# Altium schematic sheet Diff-Probe_Topsheet.SchDoc
size A3; SheetNumber: 1; SheetTotal: 2
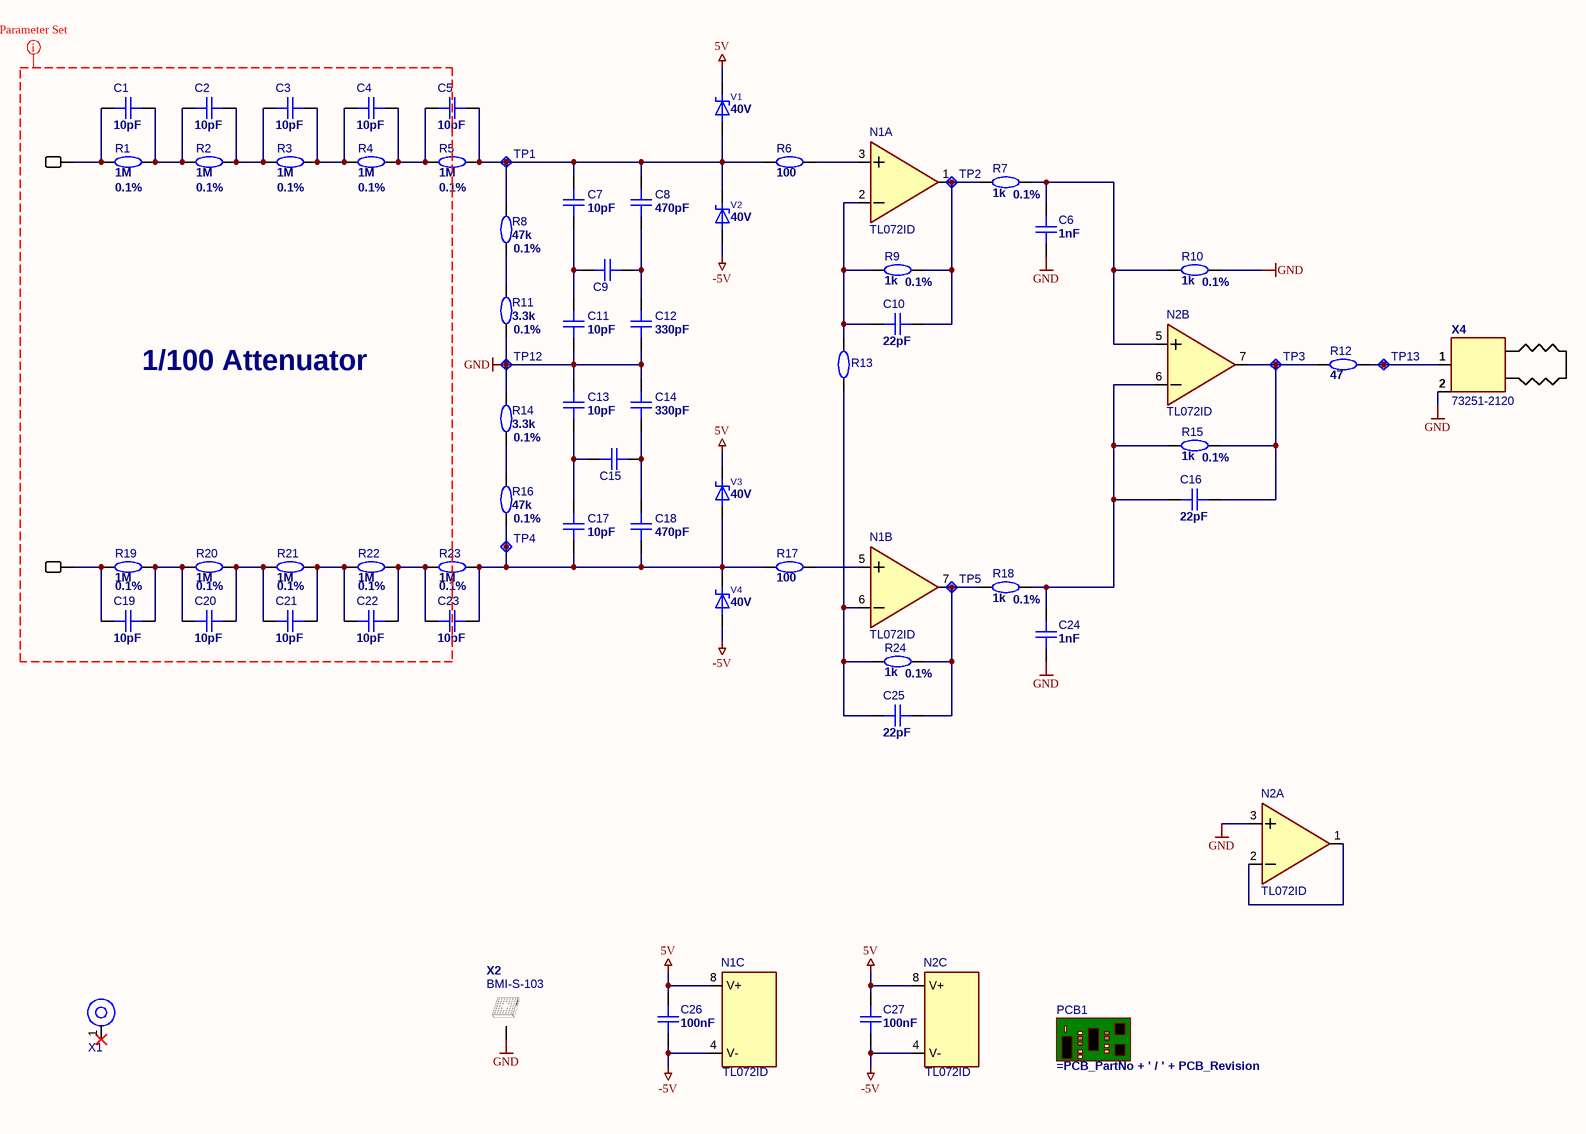
[diagram p0: Diff-Probe_Topsheet.SchDoc]

## Parts
C1  value 10pF  [C-1206_3216_100_L_RF]  (hidden comment: CAP 10PF 1KV U2J 1206)
C2  value 10pF  [C-1206_3216_100_L_RF]  (hidden comment: CAP 10PF 1KV U2J 1206)
C3  value 10pF  [C-1206_3216_100_L_RF]  (hidden comment: CAP 10PF 1KV U2J 1206)
C4  value 10pF  [C-1206_3216_100_L_RF]  (hidden comment: CAP 10PF 1KV U2J 1206)
C5  value 10pF  [C-1206_3216_100_L_RF]  (hidden comment: CAP 10PF 1KV U2J 1206)
C6  value 1nF  [C-0603_1608_100_L_RF]  (hidden comment: Cap 1n 0603)
C7  value 10pF  [C-0603_1608_095_L_RF]  (hidden comment: Cap 10p 0603)
C8  value 470pF  [C-0603_1608_095_L_RF]  (hidden comment: Cap 470p 0603)
C9  Cap 0603  [C-0603_1608_095_L_RF]  (value not drawn)
C10  value 22pF  [C-0603_1608_095_L_RF]  (hidden comment: Cap 22p 0603)
C11  value 10pF  [C-0603_1608_095_L_RF]  (hidden comment: Cap 10p 0603)
C12  value 330pF  [C-0603_1608_095_L_RF]  (hidden comment: Cap 330p 0603)
C13  value 10pF  [C-0603_1608_095_L_RF]  (hidden comment: Cap 10p 0603)
C14  value 330pF  [C-0603_1608_095_L_RF]  (hidden comment: Cap 330p 0603)
C15  Cap 0603  [C-0603_1608_095_L_RF]  (value not drawn)
C16  value 22pF  [C-0603_1608_095_L_RF]  (hidden comment: Cap 22p 0603)
C17  value 10pF  [C-0603_1608_095_L_RF]  (hidden comment: Cap 10p 0603)
C18  value 470pF  [C-0603_1608_095_L_RF]  (hidden comment: Cap 470p 0603)
C19  value 10pF  [C-1206_3216_100_L_RF]  (hidden comment: CAP 10PF 1KV U2J 1206)
C20  value 10pF  [C-1206_3216_100_L_RF]  (hidden comment: CAP 10PF 1KV U2J 1206)
C21  value 10pF  [C-1206_3216_100_L_RF]  (hidden comment: CAP 10PF 1KV U2J 1206)
C22  value 10pF  [C-1206_3216_100_L_RF]  (hidden comment: CAP 10PF 1KV U2J 1206)
C23  value 10pF  [C-1206_3216_100_L_RF]  (hidden comment: CAP 10PF 1KV U2J 1206)
C24  value 1nF  [C-0603_1608_100_L_RF]  (hidden comment: Cap 1n 0603)
C25  value 22pF  [C-0603_1608_095_L_RF]  (hidden comment: Cap 22p 0603)
C26  value 100nF  [C-0603_1608_095_L_RF]  (hidden comment: Cap 100n 0603)
C27  value 100nF  [C-0603_1608_095_L_RF]  (hidden comment: Cap 100n 0603)
N1  TL072ID  [SO8_L_RF]  (parts A,B,C of 3)
N2  TL072ID  [SO8_L_RF]  (parts A,B,C of 3)
PCB1  PCB_Dummy  [Dummy_PCB-Parameter_SM]  (value not drawn)
R1  value 1M  [R-1206_3216_065_L_RF]  (hidden comment: Res 1M 1206)
R2  value 1M  [R-1206_3216_065_L_RF]  (hidden comment: Res 1M 1206)
R3  value 1M  [R-1206_3216_065_L_RF]  (hidden comment: Res 1M 1206)
R4  value 1M  [R-1206_3216_065_L_RF]  (hidden comment: Res 1M 1206)
R5  value 1M  [R-1206_3216_065_L_RF]  (hidden comment: Res 1M 1206)
R6  value 100  [R-0603_1608_050_L_RF]  (hidden comment: Res 100R 0603)
R7  value 1k  [R-0603_1608_050_L_RF]  (hidden comment: Res 1k 0603)
R8  value 47k  [R-0603_1608_050_L_RF]  (hidden comment: Res 47k 0603)
R9  value 1k  [R-0603_1608_050_L_RF]  (hidden comment: Res 1k 0603)
R10  value 1k  [R-0603_1608_050_L_RF]  (hidden comment: Res 1k 0603)
R11  value 3.3k  [R-0603_1608_050_L_RF]  (hidden comment: Res 3k3 0603)
R12  value 47  [R-0603_1608_050_L_RF]  (hidden comment: Res 47R 0603)
R13  Res 0603  [R-0603_1608_050_L_RF]  (value not drawn)
R14  value 3.3k  [R-0603_1608_050_L_RF]  (hidden comment: Res 3k3 0603)
R15  value 1k  [R-0603_1608_050_L_RF]  (hidden comment: Res 1k 0603)
R16  value 47k  [R-0603_1608_050_L_RF]  (hidden comment: Res 47k 0603)
R17  value 100  [R-0603_1608_050_L_RF]  (hidden comment: Res 100R 0603)
R18  value 1k  [R-0603_1608_050_L_RF]  (hidden comment: Res 1k 0603)
R19  value 1M  [R-1206_3216_065_L_RF]  (hidden comment: Res 1M 1206)
R20  value 1M  [R-1206_3216_065_L_RF]  (hidden comment: Res 1M 1206)
R21  value 1M  [R-1206_3216_065_L_RF]  (hidden comment: Res 1M 1206)
R22  value 1M  [R-1206_3216_065_L_RF]  (hidden comment: Res 1M 1206)
R23  value 1M  [R-1206_3216_065_L_RF]  (hidden comment: Res 1M 1206)
R24  value 1k  [R-0603_1608_050_L_RF]  (hidden comment: Res 1k 0603)
R30  (no value)  [Lötpad_2x3]  (no BOM)
R31  (no value)  [Lötpad_2x3]  (no BOM)
TP1  TestPoint 1.6mm with via  [TP_1.6mm_via]  (value not drawn)  (no BOM)
TP2  TestPoint 1.6mm with via  [TP_1.6mm_via]  (value not drawn)  (no BOM)
TP3  TestPoint 1.6mm with via  [TP_1.6mm_via]  (value not drawn)  (no BOM)
TP4  TestPoint 1.6mm with via  [TP_1.6mm_via]  (value not drawn)  (no BOM)
TP5  TestPoint 1.6mm with via  [TP_1.6mm_via]  (value not drawn)  (no BOM)
TP12  TestPoint 1.6mm with via  [TP_1.6mm_via]  (value not drawn)  (no BOM)
TP13  TestPoint 1.6mm with via  [TP_1.6mm_via]  (value not drawn)  (no BOM)
V1  value 40V  [SMA_DO214AC_L_RF]  (hidden comment: SS14-E3)
V2  value 40V  [SMA_DO214AC_L_RF]  (hidden comment: SS14-E3)
V3  value 40V  [SMA_DO214AC_L_RF]  (hidden comment: SS14-E3)
V4  value 40V  [SMA_DO214AC_L_RF]  (hidden comment: SS14-E3)
X1  AnschlussPad_D3.2_P6mm  [A-MountingHole-0600x0600_0320]  (value not drawn)  (no BOM)
X2  BMI-S-103  [BMI-S-103]
X4  73251-2120  [73251-2120]

## Nets
5V: C26.2 C27.2 N1.8(V+) N2.8(V+) V1.2 V3.2
-5V: C26.1 C27.1 N1.4(V-) N2.4(V-) V2.1 V4.1
GND: C6.1 C11.1 C12.1 C13.2 C14.2 C24.1 N2.3 R10.2 R11.1 R14.2 TP12.1 X2.S X4.2
NetC1_1: C1.1 R1.1 R30.1
NetC1_2: C1.2 C2.1 R1.2 R2.1
NetC2_2: C2.2 C3.1 R2.2 R3.1
NetC3_2: C3.2 C4.1 R3.2 R4.1
NetC4_2: C4.2 C5.1 R4.2 R5.1
NetC5_2: C5.2 C7.2 C8.2 R5.2 R6.1 R8.2 TP1.1 V1.1 V2.2
NetC6_2: C6.2 N2.5 R7.2 R10.1
NetC7_1: C7.1 C9.2 C11.2
NetC8_1: C8.1 C9.1 C12.2
NetC10_1: C10.1 N1.2 R9.1 R13.2
NetC10_2: C10.2 N1.1 R7.1 R9.2 TP2.1
NetC13_1: C13.1 C15.2 C17.2
NetC14_1: C14.1 C15.1 C18.2
NetC16_1: C16.1 C24.2 N2.6 R15.1 R18.2
NetC16_2: C16.2 N2.7 R12.1 R15.2 TP3.1
NetC17_1: C17.1 C18.1 C23.2 R16.1 R17.1 R23.2 TP4.1 V3.1 V4.2
NetC19_1: C19.1 R19.1 R31.1
NetC19_2: C19.2 C20.1 R19.2 R20.1
NetC20_2: C20.2 C21.1 R20.2 R21.1
NetC21_2: C21.2 C22.1 R21.2 R22.1
NetC22_2: C22.2 C23.1 R22.2 R23.1
NetC25_1: C25.1 N1.6 R13.1 R24.1
NetC25_2: C25.2 N1.7 R18.1 R24.2 TP5.1
NetN1_3: N1.3 R6.2
NetN1_5: N1.5 R17.2
NetN2_1: N2.1 N2.2
NetR8_1: R8.1 R11.2
NetR12_2: R12.2 TP13.1 X4.1
NetR14_1: R14.1 R16.2

Not connected (* = marked no-connect by the designer): X1 1*

## Layout directives
net class Business-End: (no net found under the mark)

## Notes on the sheet
- (near R1) 0.1%
- (near R2) 0.1%
- (near R3) 0.1%
- (near R4) 0.1%
- (near R5) 0.1%
- (near R8) 0.1%
- (near R7) 0.1%
- (near R9) 0.1%
- (near R10) 0.1%
- 1/100 Attenuator
- (near R11) 0.1%
- (near R14) 0.1%
- (near R16) 0.1%
- (near R15) 0.1%
- (near R19) 0.1%
- (near R20) 0.1%
- (near R21) 0.1%
- (near R22) 0.1%
- (near R23) 0.1%
- (near R18) 0.1%
- (near R24) 0.1%
- DWG. NO.
- REV.
- SHT.
- REVISION
- DESCRIPTION
- DATE
- APPROVED
- THIS DOCUMENT AND THE DATA DISCLOSED HEREIN OR HEREWITH IS THE PROPERTY OF ALTIUM LIMITED AND MAY BE FREELY DISTRIBUTED IN WHOLE. NO RIGHTS ARE RESERVED OR EXPRESS OR IMPLIED WARANTEE GIVEN.
- ENG:
- DSN:
- APPROVALS
- PROJECT
- DOCUMENT REVISION:
- DESIGN ITEM:
- CHK:
- BOM:
- REFERENCE DOCUMENTS
- PROJECT REVISION:
- TITLE
- FAB DWG:
- PCB DWG:
- ASSY DWG:
- SCALE:
- SIZE
- C
- CAGE CODE
- FILE NAME
- DWG NO.
- SHEET
- OF
- REV

## Library data of the parts
C1-C5 C19-C23 = CMP-00003-1: CAP CER 10PF 1KV U2J 1206; Part_validated: Yes; Part: Cap Dummy; Prefered: False; Type: C; User: zupa; Case/Package: 1206; ClassName: Surface_Assy; MNL_Number: *; System: -; Footprint_validated: Yes; Technology: SMT; PartStatus: New
C6 C24 = CMP-001-0174-2: Cap Cer SMD 1n 50V 1% 0603 C0G; Manufacturer Part Number: 06035A102FAT*; Manufacturer: AVX; Prefered: true; GPV_Number: 1749.0018; User: zupa; PartStatus: Release; Technology: SMT; ComponentLink1Description: Datasheet; Case / Package: 0603; ComponentLink1URL: https://datasheet.ciiva.com/26939/getdatasheetpartid-734047-26939692.pdf; ClassName: Surface_Assy
C7 C11 C13 C17 = CMP-001-0041-2: Cap Cer SMD 10p 50V +/- 0.25pF  0603 C0G; Manufacturer: AVX; Manufacturer Part Number: 06035A100CAT*; GPV_Number: 1749.0090; User: zupa; Prefered: true; Case / Package: 0603; ClassName: Surface_Assy; PartStatus: Release; Technology: SMT; ComponentLink1Description: Datasheet; ComponentLink1URL: https://datasheet.ciiva.com/11464/ccog-11464569.pdf
C8 C18 = CMP-001-0054-2: Cap Cer SMD 470p 100V 10% 0603 X7R; Manufacturer: AVX; Manufacturer Part Number: 06031C471KAT2A; GPV_Number: 1749.0037; User: zupa; Prefered: true; Case / Package: 0603; ClassName: Surface_Assy; PartStatus: Release; Technology: SMT; ComponentLink1URL: https://datasheet.ciiva.com/150/cx7r-150686.pdf; ComponentLink1Description: Datasheet
C9 C15 = CMP-001-0113-2: Cap Cer SMD ?n ?V ?% 0603 ?; User: zupa; Manufacturer: ?; Case / Package: 0603; Manufacturer Part Number: ?; GPV_Number: ?; ClassName: Surface_Assy; PartStatus: Release; Technology: SMT
C10 C16 C25 = CMP-001-0048-2: Cap Cer SMD 22p 50V 5% 0603 C0G; Manufacturer: AVX; Manufacturer Part Number: 06035A220JAT; Prefered: true; GPV_Number: 1749.0023; User: zupa; ComponentLink1URL: https://datasheet.ciiva.com/11464/ccog-11464569.pdf; Technology: SMT; Case / Package: 0603; ClassName: Surface_Assy; PartStatus: Release; ComponentLink1Description: Datasheet
C12 C14 = CMP-001-0004-2: Cap Cer SMD 330p 50V 2% 0603 C0G; Manufacturer: MURATA; Manufacturer Part Number: GRM1885C1H331GA01D; GPV_Number: 1749.0120; User: zupa; Prefered: true; Case / Package: 0603; ClassName: Surface_Assy; PartStatus: Release; Technology: SMT; ComponentLink1URL: https://datasheet.ciiva.com/29538/grm1885c1h331ga01-01-29538011.pdf; ComponentLink1Description: Datasheet
C26 C27 = CMP-001-0036-2: Cap Cer SMD 100n 100V 10% 0603 X7R; Manufacturer Part Number: GRM188R72A104KA35; Manufacturer: MURATA; GPV_Number: 1749.0196; User: zupa; Prefered: false; Case / Package: 0603; ComponentLink1Description: Datasheet; PartStatus: Release; ComponentLink1URL: https://datasheet.ciiva.com/34302/1857815-34302863.pdf; ClassName: Surface_Assy; Technology: SMT
N1 N2 = CMP-001-1317-2: IC OPAMP JFET 3MHZ 8SOIC; Manufacturer: Texas Instruments; Manufacturer Part Number: TL072IDR; User: zupa; GPV_Number: 1500.5508; Case / Package: SO8; Value: TL072ID; ComponentLink1URL: http://www.ti.com/lit/ds/symlink/tl071a.pdf; Technology: SMT; ComponentLink1Description: Datasheet; ClassName: Surface_Assy; PartStatus: Release
PCB1 = CMP-001-1147-4: <PCB DesignName Revision>; User: balu; ClassName: Symbol; Technology: SYM; GPV_Number: =PCB_PartNo; Value: =PCB_PartNo + ' / ' + PCB_Revision; PartStatus: Release
R1-R5 R19-R23 = CMP-001-0316-3: Res SMD 1M 1% 0.25W 1206; Manufacturer Part Number: RC1206FR-071ML; Manufacturer: YAGEO; GPV_Number: 1921.0180; User: zupa; MNL_Number: 15310041; Prefered: true; ClassName: Surface_Assy; ComponentLink1URL: https://datasheet.ciiva.com/11819/0900766b80c6630a-11819896.pdf; ComponentLink1Description: Datasheet; PartStatus: Release; Case / Package: 1206; Technology: SMT
R6 R17 = CMP-001-0240-3: Res SMD 100R 1% 0.1W 0603; Manufacturer: YAGEO; Manufacturer Part Number: RC0603FR-07100RL; Prefered: true; User: zupa; MNL_Number: 15310004; GPV_Number: 1922.0102; ClassName: Surface_Assy; Case / Package: 0603; ComponentLink1Description: Datasheet; Technology: SMT; ComponentLink1URL: https://datasheet.ciiva.com/11808/0900766b80f96399-11808280.pdf; PartStatus: Release
R7 R18 = CMP-001-0250-3: Res SMD 1k 1% 0.1W 0603; Manufacturer: YAGEO; Manufacturer Part Number: RC0603FR-071KL; MNL_Number: 15310012; User: zupa; GPV_Number: 1922.0011; Prefered: true; Technology: SMT; ComponentLink1Description: Datasheet; ClassName: Surface_Assy; ComponentLink1URL: https://datasheet.ciiva.com/11808/0900766b80f96399-11808280.pdf; Case / Package: 0603; PartStatus: Release
R8 R16 = CMP-001-0271-3: Res SMD 47k 1% 0.1W 0603; Manufacturer Part Number: RC0603FR-0747KL; Manufacturer: YAGEO; User: zupa; Prefered: true; GPV_Number: 1922.0044; Case / Package: 0603; PartStatus: Release; Technology: SMT; ComponentLink1URL: https://datasheet.ciiva.com/11808/0900766b80f96399-11808280.pdf; ClassName: Surface_Assy; ComponentLink1Description: Datasheet
R9 R10 R15 R24 = CMP-001-0250-3: Res SMD 1k 1% 0.1W 0603; Manufacturer: YAGEO; Manufacturer Part Number: RC0603FR-071KL; MNL_Number: 15310012; GPV_Number: 1922.0011; User: zupa; Prefered: true; Case / Package: 0603; ClassName: Surface_Assy; PartStatus: Release; ComponentLink1URL: https://datasheet.ciiva.com/11808/0900766b80f96399-11808280.pdf; ComponentLink1Description: Datasheet; Technology: SMT
R11 R14 = CMP-001-0580-3: Res SMD 3k3 1% 0.1W 0603; Manufacturer: YAGEO; Manufacturer Part Number: RT0603FRE073K3L; Prefered: true; GPV_Number: 1922.1554; User: napa; Technology: SMT; Case / Package: 0603; ClassName: Surface_Assy; ComponentLink1URL: https://datasheet.ciiva.com/7746/1392914-7746698.pdf; PartStatus: Release; ComponentLink1Description: Datasheet
R12 = CMP-001-0272-3: Res SMD 47R 1% 0.1W 0603; Manufacturer Part Number: RC0603FR-0747RL; Manufacturer: YAGEO; GPV_Number: 1922.0015; Prefered: true; User: zupa; Case / Package: 0603; ClassName: Surface_Assy; ComponentLink1URL: https://datasheet.ciiva.com/11808/0900766b80f96399-11808280.pdf; ComponentLink1Description: Datasheet; PartStatus: Release; Technology: SMT
R13 = CMP-001-0334-3: Res SMD ?R? ?% 0.1W 0603; User: zupa; Manufacturer: ?; Technology: SMT; GPV_Number: ?; PartStatus: Draft; ClassName: Surface_Assy; Manufacturer Part Number: ?
R30 R31 = Lötpad_2mmx3mm: Solderpad 2mm x 3mm; Part_validated: No; GPV_Number: xxxx.xxxx; System: Connector; MNL_Number: xxxxxxxx; Footprint_validated: No; PartStatus: New; Case/Package: -; Technology: SMT; Manufacturer: -; Manufacturer Part Number: -; ClassName: Testpoint
TP1-TP5 TP12 TP13 = CMP-00087-1: TestPoint 1.6mm with via v70h30; User: epph; Value: TP; GPV_Number: -; ClassName: Testpoint; PartStatus: Release; Technology: SMT
V1-V4 = CMP-00074-1: Diode Schottky 40V 1A SMA; Manufacturer: VISHAY; GPV_Number: 1600.1206; User: epph; PartStatus: New; Technology: SMT; Manufacturer Part Number: SS14-E3; ClassName: Surface_Assy; Case / Package: SMA
X1 = CMP-00068-3: Anschlusspad mit 6mm Pad und 3.2mm Drill; Technology: SMT; ClassName: Testpoint; GPV_Number: -
X2 = BMI-S-103: EMI Shield 26.2mm x 26.2mm, soldered; Part_validated: Yes | No; Manufacturer: Laird; GPV_Number: xxxx.xxxx; System: Connector; MNL_Number: xxxxxxxx; Value: BMI-S-103; Footprint_validated: Yes | No; PartStatus: New | Draft | Release; ClassName: Surface_Assy | Testpoint | Through-Hole_Assy | NetTie | Symbol | Mechanical; Case/Package: 0201 | 0402 | 0603 | 0805 | 1206 | SO8 | SO16 |; Technology: SMT | THT | SMT-BTC; Manufacturer Part Number: BMI-S-103
X4 = 73251-2120: CONN RF SMA; Part_validated: No; Manufacturer: MOLEX; GPV_Number: xxxx.xxxx; System: Connector; MNL_Number: xxxxxxxx; Value: 73251-2120; Footprint_validated: No; PartStatus: New; ClassName: Through-Hole_Assy; Case/Package: SMA; Technology: THT; Manufacturer Part Number: 73251-2120